# EAGLE schematic 2.0 (EAGLE 6.1)
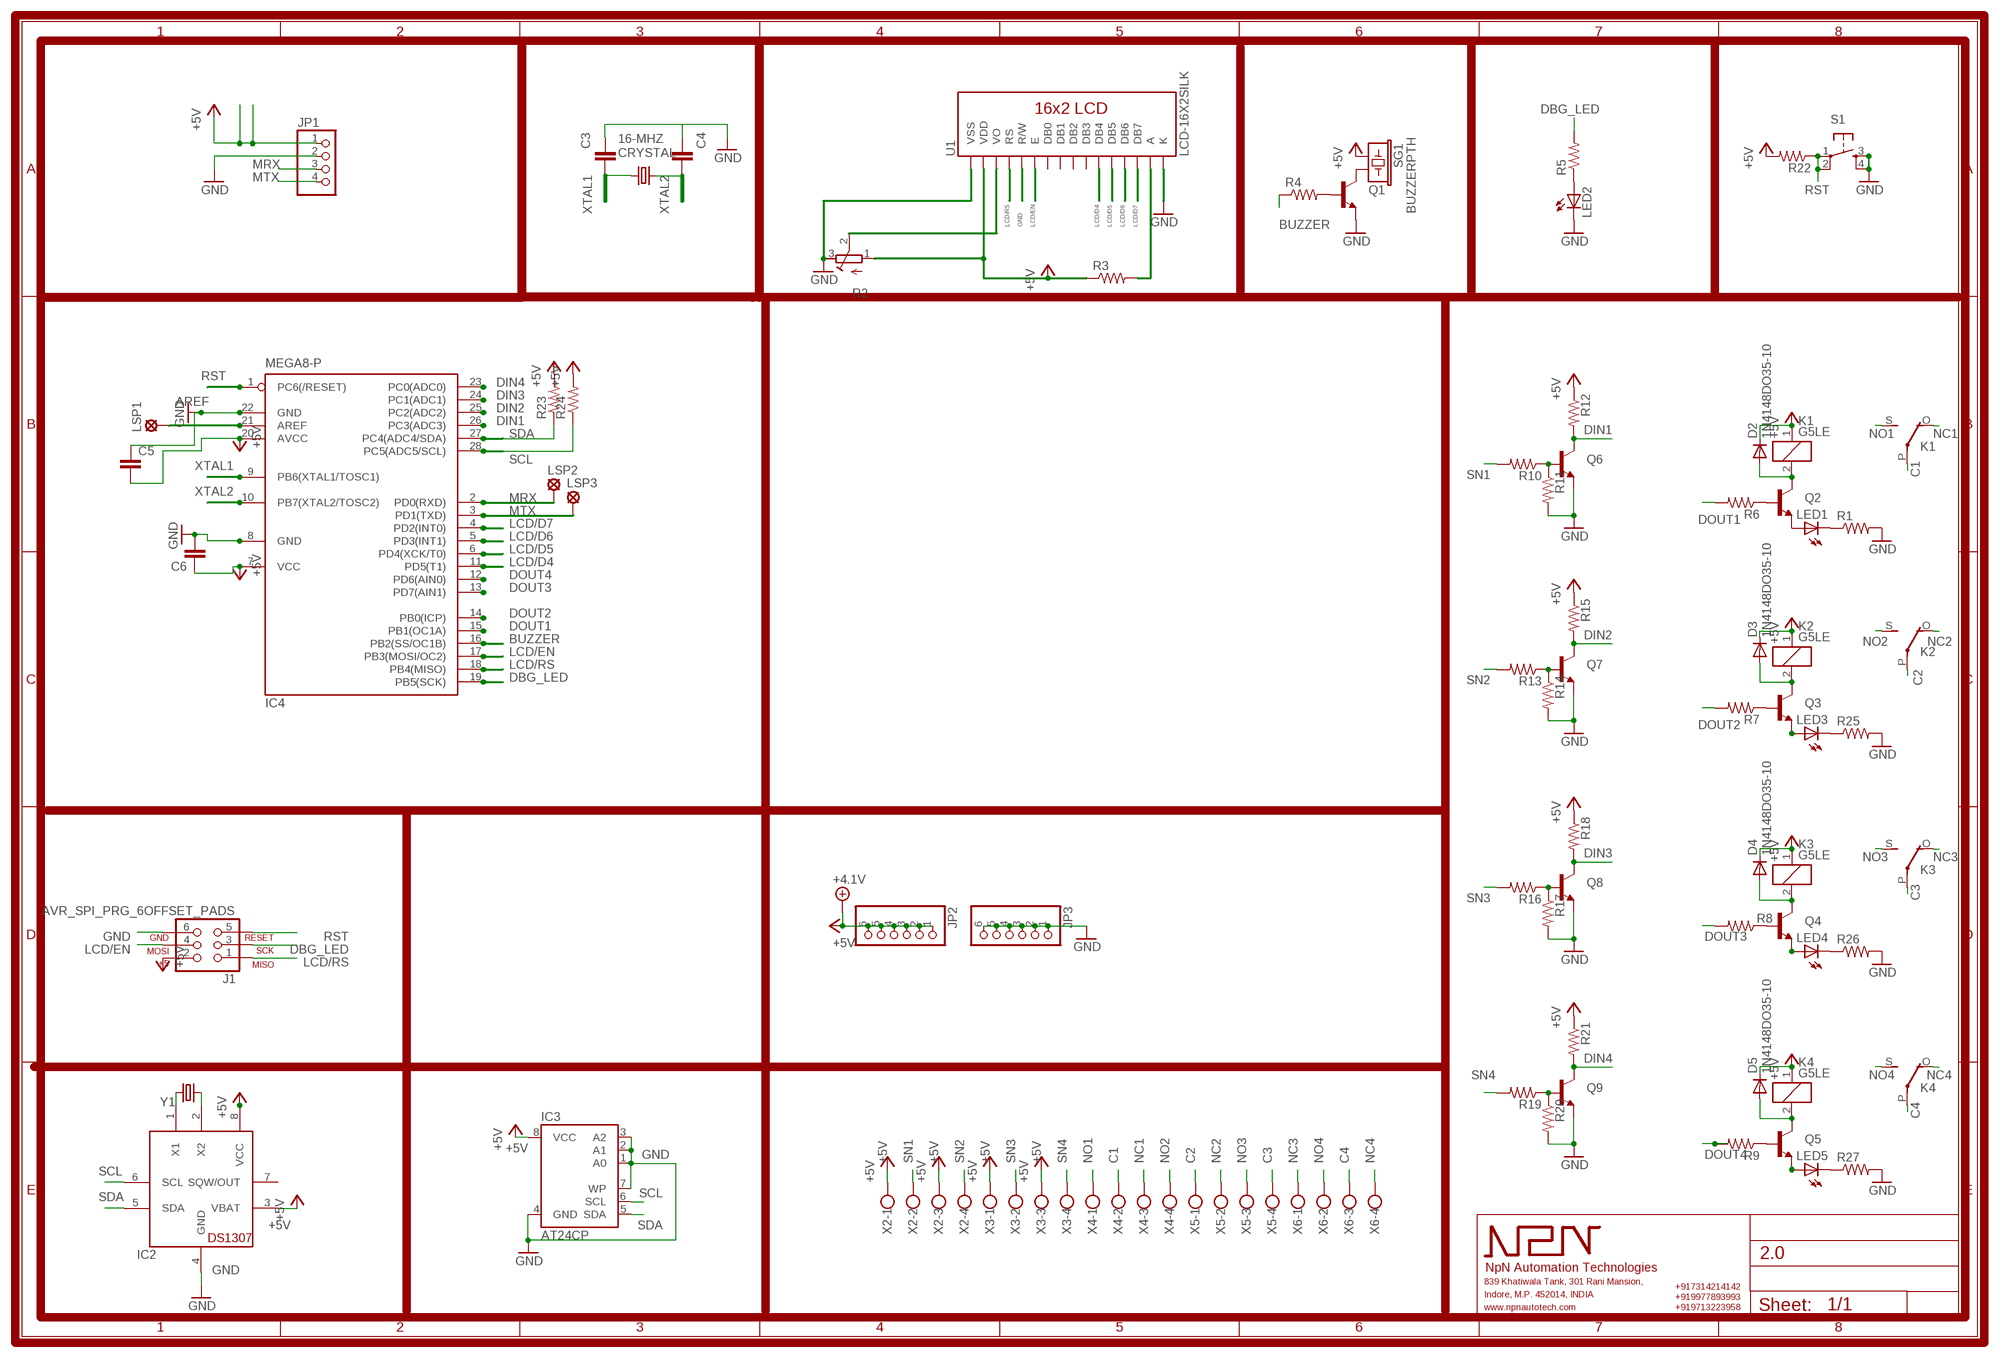
[diagram p0: schematic, sheet 1]

## Parts
C3  CAPPTH1  [CAP-PTH-5MM]
C4  CAPPTH1  [CAP-PTH-5MM]
C5  CAPPTH1  [CAP-PTH-5MM]
C6  CAPPTH1  [CAP-PTH-5MM]
CRYSTAL  16-MHZ  CRYSTALHC49UV  [HC49U-V]
D2  1N4148DO35-10  [DO35-10]
D3  1N4148DO35-10  [DO35-10]
D4  1N4148DO35-10  [DO35-10]
D5  1N4148DO35-10  [DO35-10]
IC2  DS1307  [DIL08]
IC3  AT24CP  [DIL08]
IC4  MEGA8-P  [DIL28-3]
J1  AVR_SPI_PRG_6OFFSET_PADS  [2X3_OFFSET]
JP1  PINHD-1X4  [1X04]
JP2  PINHD-1X6  [1X06]
JP3  PINHD-1X6  [1X06]
K1  G5LE  [G5LE]
K2  G5LE  [G5LE]
K3  G5LE  [G5LE]
K4  G5LE  [G5LE]
LED1  LED5MM  [LED5MM]
LED2  LED5MM  [LED5MM]
LED3  LED5MM  [LED5MM]
LED4  LED5MM  [LED5MM]
LED5  LED5MM  [LED5MM]
LSP1  LSP11  [LSP11]
LSP2  MCS10B  [MCS10B]
LSP3  MCS10B  [MCS10B]
Q1  TRANSISTOR_NPNTO-92-AMMO  [TO-92-AMMO]
Q2  TRANSISTOR_NPNTO-92-AMMO  [TO-92-AMMO]
Q3  TRANSISTOR_NPNTO-92-AMMO  [TO-92-AMMO]
Q4  TRANSISTOR_NPNTO-92-AMMO  [TO-92-AMMO]
Q5  TRANSISTOR_NPNTO-92-AMMO  [TO-92-AMMO]
Q6  TRANSISTOR_NPNTO-92-AMMO  [TO-92-AMMO]
Q7  TRANSISTOR_NPNTO-92-AMMO  [TO-92-AMMO]
Q8  TRANSISTOR_NPNTO-92-AMMO  [TO-92-AMMO]
Q9  TRANSISTOR_NPNTO-92-AMMO  [TO-92-AMMO]
R1  R-US_0207/10  [0207/10]
R2  R-TRIMM3339P  [RTRIM3339P]
R3  R-US_0207/15  [0207/15]
R4  R-US_0207/12  [0207/12]
R5  R-US_0207/12  [0207/12]
R6  R-US_M1206  [M1206]
R7  R-US_M1206  [M1206]
R8  R-US_M1206  [M1206]
R9  R-US_M1206  [M1206]
R10  R-US_M1206  [M1206]
R11  R-US_0207/10  [0207/10]
R12  R-US_M1206  [M1206]
R13  R-US_M1206  [M1206]
R14  R-US_M1206  [M1206]
R15  R-US_M1206  [M1206]
R16  R-US_M1206  [M1206]
R17  R-US_M1206  [M1206]
R18  R-US_M1206  [M1206]
R19  R-US_M1206  [M1206]
R20  R-US_M1206  [M1206]
R21  R-US_M1206  [M1206]
R22  R-US_M1206  [M1206]
R23  R-US_0207/10  [0207/10]
R24  R-US_0207/10  [0207/10]
R25  R-US_0207/10  [0207/10]
R26  R-US_0207/10  [0207/10]
R27  R-US_0207/10  [0207/10]
S1  TAC_SWITCHPTH  [TACTILE-PTH]
SG1  BUZZERPTH  [BUZZER-12MM]
U1  LCD-16X2SILK  [LCD-16X2]
X2  W237-4  [W237-4]
X3  W237-4  [W237-4]
X4  W237-4  [W237-4]
X5  W237-4  [W237-4]
X6  W237-4  [W237-4]
Y1  CRYSTALTC38H  [TC38H]

## Nets
+5V: C5.2 C6.1 D2.C D3.C D4.C D5.C IC2.3(VBAT) IC2.8(VCC) IC3.8(VCC) IC4.7(VCC) IC4.20(AVCC) J1.2 JP1.1 JP2.1 JP2.2 JP2.3 JP2.4 JP2.5 JP2.6 K1.1 K2.1 K3.1 K4.1 R2.1(A) R3.1 R12.1 R15.1 R18.1 R21.1 R22.2 R23.2 R24.2 SG1.+ U1.2(VDD) X2.1 X2.3 X3.1 X3.3 ; supply symbol labelled +4.1V
AREF: IC4.21(AREF) LSP1.MP
BUZZER: IC4.16(PB2(SS/OC1B)) R4.1
C1: K1.P(2:P) X4.2
C2: K2.P(2:P) X5.1
C3: K3.P(2:P) X5.4
C4: K4.P(2:P) X6.3
DBG_LED: IC4.19(PB5(SCK)) J1.3 R5.2
DIN1: IC4.26(PC3(ADC3)) Q6.3(C) R12.2
DIN2: IC4.25(PC2(ADC2)) Q7.3(C) R15.2
DIN3: IC4.24(PC1(ADC1)) Q8.3(C) R18.2
DIN4: IC4.23(PC0(ADC0)) Q9.3(C) R21.2
DOUT1: IC4.15(PB1(OC1A)) R6.2
DOUT2: IC4.14(PB0(ICP)) R7.2
DOUT3: IC4.13(PD7(AIN1)) R8.2
DOUT4: IC4.12(PD6(AIN0)) R9.2
GND: C3.1 C4.1 C5.1 C6.2 IC2.4(GND) IC3.1(A0) IC3.2(A1) IC3.3(A2) IC3.4(GND) IC3.7(WP) IC4.8(GND) IC4.22(GND) J1.6 JP1.2 JP3.1 JP3.2 JP3.3 JP3.4 JP3.5 JP3.6 LED2.K(C) Q1.1(E) Q6.1(E) Q7.1(E) Q8.1(E) Q9.1(E) R1.2 R2.3(E) R11.2 R14.2 R17.2 R20.2 R25.2 R26.2 R27.2 S1.3 S1.4 U1.1(VSS) U1.5(R/W) U1.16(K)
LCD/D4: IC4.11(PD5(T1)) U1.11(DB4)
LCD/D5: IC4.6(PD4(XCK/T0)) U1.12(DB5)
LCD/D6: IC4.5(PD3(INT1)) U1.13(DB6)
LCD/D7: IC4.4(PD2(INT0)) U1.14(DB7)
LCD/EN: IC4.17(PB3(MOSI/OC2)) J1.4 U1.6(E)
LCD/RS: IC4.18(PB4(MISO)) J1.1 U1.4(RS)
MRX: IC4.2(PD0(RXD)) JP1.3 LSP2.MP
MTX: IC4.3(PD1(TXD)) JP1.4 LSP3.MP
N$1: LED1.A Q2.1(E)
N$2: LED3.K(C) R25.1
N$3: LED4.K(C) R26.1
N$4: LED5.K(C) R27.1
N$5: LED3.A Q3.1(E)
N$6: R2.2(S) U1.3(VO)
N$7: Q1.3(C) SG1.-
N$8: Q1.2(B) R4.2
N$9: LED2.A R5.1
N$10: D2.A K1.2 Q2.3(C)
N$11: Q2.2(B) R6.1
N$12: D3.A K2.2 Q3.3(C)
N$13: Q3.2(B) R7.1
N$14: R3.2 U1.15(A)
N$15: LED4.A Q4.1(E)
N$16: LED5.A Q5.1(E)
N$17: D4.A K3.2 Q4.3(C)
N$18: Q4.2(B) R8.1
N$19: D5.A K4.2 Q5.3(C)
N$20: Q5.2(B) R9.1
N$21: Q6.2(B) R10.1 R11.1
N$22: LED1.K(C) R1.1
N$25: Q7.2(B) R13.1 R14.1
N$28: Q8.2(B) R16.1 R17.1
N$29: IC2.1(X1) Y1.2
N$31: Q9.2(B) R19.1 R20.1
N$32: IC2.2(X2) Y1.1
NC1: K1.O(2:O) X4.3
NC2: K2.O(2:O) X5.2
NC3: K3.O(2:O) X6.1
NC4: K4.O(2:O) X6.4
NO1: K1.S(2:S) X4.1
NO2: K2.S(2:S) X4.4
NO3: K3.S(2:S) X5.3
NO4: K4.S(2:S) X6.2
RST: IC4.1(PC6(/RESET)) J1.5 R22.1 S1.1 S1.2
SCL: IC2.6(SCL) IC3.6(SCL) IC4.28(PC5(ADC5/SCL)) R24.1
SDA: IC2.5(SDA) IC3.5(SDA) IC4.27(PC4(ADC4/SDA)) R23.1
SN1: R10.2 X2.2
SN2: R13.2 X2.4
SN3: R16.2 X3.2
SN4: R19.2 X3.4
XTAL1: C3.2 CRYSTAL.1 IC4.9(PB6(XTAL1/TOSC1))
XTAL2: C4.2 CRYSTAL.2 IC4.10(PB7(XTAL2/TOSC2))
Unconnected: IC2.7(SQW/OUT) U1.7(DB0) U1.8(DB1) U1.9(DB2) U1.10(DB3)

## Library data of the parts
C3-C6 = SparkFun_NPN:CAP: Capacitor Standard 0603 ceramic capacitor, and 0.1" leaded capacitor.
CRYSTAL Y1 = SparkFun_NPN:CRYSTAL: Crystals Various standard crystals. Proven footprints. Spark Fun Electronics SKU : COM-00534
D2-D5 = diode:1N4148: DIODE high speed (Philips)
IC2 = adafruit:DS1307: DS1307 Real time clock (RTC) with battery backup ability. Talk to it via i2c
IC3 = atmel:AT24C*: 2-wire serial EEPROM; MPN: AT24C1024BW-SH-B; OC_FARNELL: 1362646; OC_NEWARK: 03P2044
IC4 = atmel:MEGA8-P: MICROCONTROLLER 8 Kbytes FLASH, 1 kbytes SRAM, 512 bytes EEPROM, USART, 4-channel 10 bit ADC, 2-channel 8 bit ADC Pin compatible with Atmega48, ATMega88, ATMega168 Source: avr.lbr; OC_FARNELL: unknown; OC_NEWARK: unknown
J1 = SparkFun:AVR_SPI_PRG_6: AVR ISP 6 Pin This is the reduced ISP connector for AVR programming. Common on Arduino. This footprint will take up less PCB space and can be used with a 10-pin to 6-pin adapter such as SKU: BOB-08508
JP1 = pinhead:PINHD-1X4: PIN HEADER
JP2 JP3 = pinhead:PINHD-1X6: PIN HEADER
K1-K4 = relay:G5LE: RELAY 1 x switch, 10 A/120 V AC, 8 A/30 V DC, Omron; OC_FARNELL: unknown; OC_NEWARK: unknown
LED1-LED5 = led:LED: LED OSRAM: - CHIPLED LG R971, LG N971, LY N971, LG Q971, LY Q971, LO R971, LY R971 LH N974, LH R974 LS Q976, LO Q976, LY Q976 LO Q996 - Hyper CHIPLED LW Q18S LB Q993, LB Q99A, LB R99A - SideLED LS A670, LO A670, LY A670, LG A670, LP A670 LB A673, LV A673, LT A673, LW A673 LH A674 LY A675 LS A676, LA A676, LO A676, LY A676, LW A676 LS A679, LY A679, LG A679 - Hyper Micro SIDELED® LS Y876, LA Y876, LO Y876, LY Y876 LT Y87S - SmartLED LW L88C, LW L88S LB L89C, LB L89S, LG L890 LS L89K, LO L89K, LY L89K LS L896, LA L896, LO L896, LY L896 - TOPLED LS T670, LO T670, LY T670, LG T670, LP T670 LSG T670, LSP T670, LSY T670, LOP T670, LYG T670 LG T671, LOG T671, LSG T671 LB T673, LV T673, LT T673, LW T673 LH T674 LS T676, LA T676, LO T676, LY T676, LB T676, LH T676, LSB T676, LW T676 LB T67C, LV T67C, LT T67C, LS T67K, LO T67K, LY T67K, LW E67C LS E67B, LA E67B, LO E67B, LY E67B, LB E67C, LV E67C, LT E67C LW T67C LS T679, LY T679, LG T679 LS T770, LO T770, LY T770, LG T770, LP T770 LB T773, LV T773, LT T773, LW T773 LH T774 LS E675, LA E675, LY E675, LS T675 LS T776, LA T776, LO T776, LY T776, LB T776 LHGB T686 LT T68C, LB T68C - Hyper Mini TOPLED® LB M676 - Mini TOPLED Santana® LG M470 LS M47K, LO M47K, LY M47K Source: http://www.osram.convergy.de LUXEON: - LUMILED® LXK2-PW12-R00, LXK2-PW12-S00, LXK2-PW14-U00, LXK2-PW14-V00 LXK2-PM12-R00, LXK2-PM12-S00, LXK2-PM14-U00 LXK2-PE12-Q00, LXK2-PE12-R00, LXK2-PE12-S00, LXK2-PE14-T00, LXK2-PE14-U00 LXK2-PB12-K00, LXK2-PB12-L00, LXK2-PB12-M00, LXK2-PB14-N00, LXK2-PB14-P00, LXK2-PB14-Q00 LXK2-PR12-L00, LXK2-PR12-M00, LXK2-PR14-Q00, LXK2-PR14-R00 LXK2-PD12-Q00, LXK2-PD12-R00, LXK2-PD12-S00 LXK2-PH12-R00, LXK2-PH12-S00 LXK2-PL12-P00, LXK2-PL12-Q00, LXK2-PL12-R00 Source: www.luxeon.com KINGBRIGHT: KA-3528ASYC Source: www.kingbright.com
LSP1 = solpad:LSP11: SOLDER PAD drill 1.1 mm
LSP2 LSP3 = solpad:MCS10B: SOLDER PAD MC S1, distributor Buerklin, 15F505
Q1-Q9 = SparkFun_NPN:TRANSISTOR_NPN: Transistor NPN BJT configuration in SOT23 package. MMBT2222 is the common NPN we use. Double check BCE configuration again layout.
R1 R3-R5 R11 R23-R27 = rcl:R-US_: RESISTOR, American symbol
R2 = rcl:R-TRIMM: Trimm resistor
R6-R10 R12-R22 = resistor:R-US_: RESISTOR, American symbol
S1 = SparkFun_NPN:TAC_SWITCH: Momentary Switch Button commonly used for reset or general input. Spark Fun Electronics SKU : COM-00097
SG1 = SparkFun_NPN:BUZZER: Buzzer 12mm Spark Fun Electronics SKU : Comp-Buzzer
U1 = SparkFun_NPN:LCD-16X2
X2-X6 = con-wago-500:W237-4: WAGO SCREW CLAMP; OC_FARNELL: unknown; OC_NEWARK: unknown